# EAGLE design tinyLight_v1.1 (EAGLE 7.5.0)
tinyLight Small Serial USB device with WS2801 LED-Interface. Includes various meassurements and unused I/O-Pads.
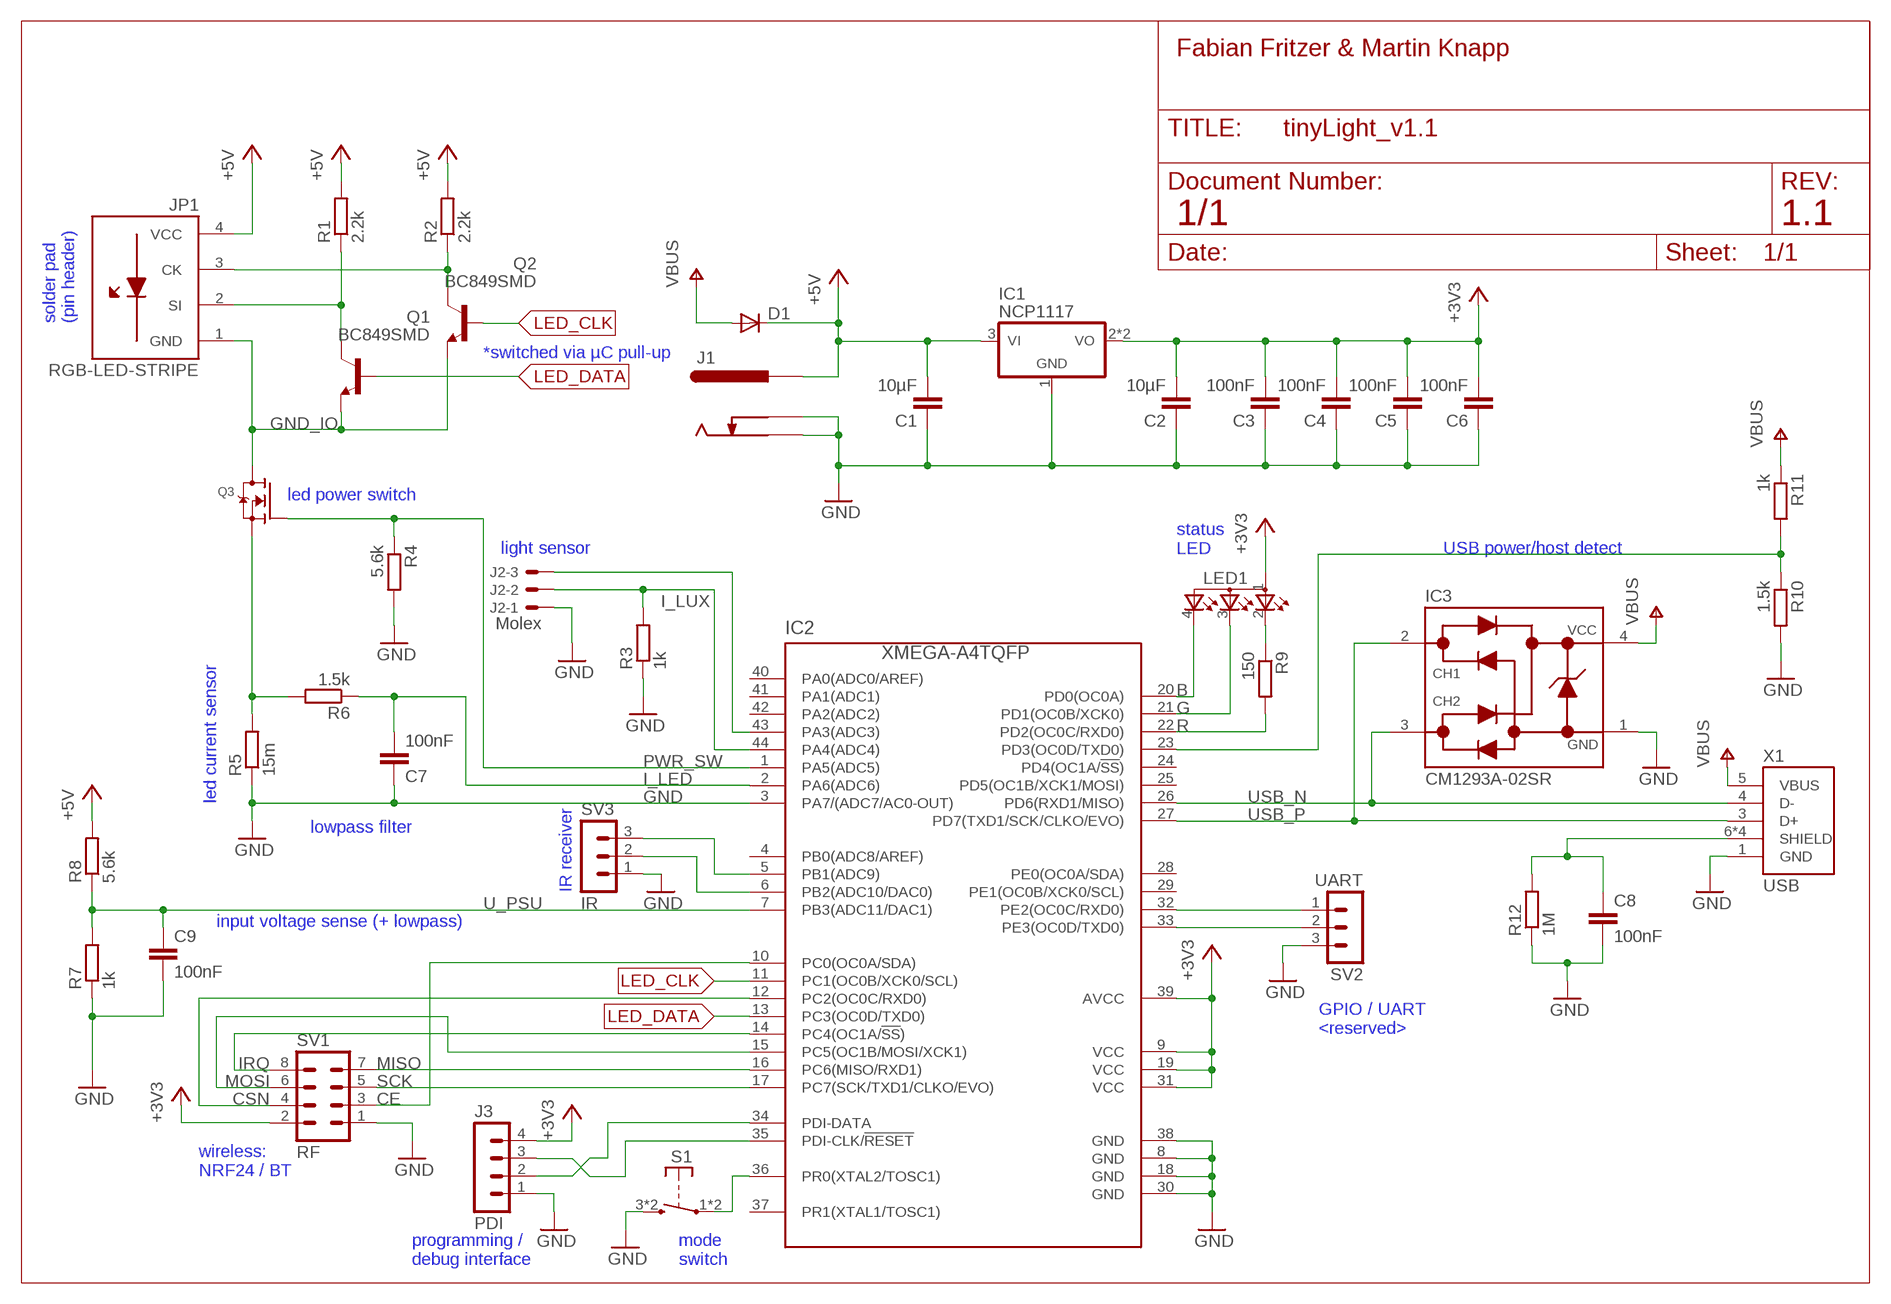
[diagram p0: schematic, sheet 1]

## Parts
C1  10µF  C-EUC2012  [C2012]
C2  10µF  C-EUC2012  [C2012]
C3  100nF  C-EUC2012  [C2012]
C4  100nF  C-EUC2012  [C2012]
C5  100nF  C-EUC2012  [C2012]
C6  100nF  C-EUC2012  [C2012]
C7  100nF  C-EUC2012  [C2012]
C8  100nF  C-EUC2012  [C2012]
C9  100nF  C-EUC2012  [C2012]
D1  DIODE-DO-214AC  [DO-214AC]
IC1  NCP1117  [SOT223]
IC2  XMEGA-A4TQFP  [TQFP44]
IC3  CM1293A-02SR  [SOT143]
J1  RASM722PX  [RASM722PX]
J2  Molex  22-27-2031-03  [6410-03]
J3  PDI  MA04-1  [MA04-1]
JP1  RGB-LED-STRIPE  [LED-STRIPE]
LED1  RGB-LEDMINI  [P-LCC-4_M]
Q1  BC849SMD  [SOT23-BEC]
Q2  BC849SMD  [SOT23-BEC]
Q3  MOSFET-N  [SOT457R_PHILIPS]
R1  2.2k  R-EU_M2012  [M2012]
R2  2.2k  R-EU_M2012  [M2012]
R3  1k  R-EU_M2012  [M2012]
R4  5.6k  R-EU_M2012  [M2012]
R5  15m  R-EU_M3216  [M3216]
R6  1.5k  R-EU_M2012  [M2012]
R7  1k  R-EU_M2012  [M2012]
R8  5.6k  R-EU_M2012  [M2012]
R9  150  R-EU_M2012  [M2012]
R10  1.5k  R-EU_M2012  [M2012]
R11  1k  R-EU_M2012  [M2012]
R12  1M  R-EU_M2012  [M2012]
S1  SPST_PB  [LSH_6X6]
SV1  RF  MA04-2  [MA04-2]
SV2  UART  MA03-1  [MA03-1]
SV3  IR  MA03-1  [MA03-1]
X1  MICRO-USB  [MIKRO_B]

## Nets
+3V3: C2.2 C3.2 C4.2 C5.2 C6.2 IC1.2(VOUT) IC1.T(VOUT) IC2.9(VCC) IC2.19(VCC) IC2.31(VCC) IC2.39(AVCC) J3.4 LED1.1(ANODE) SV1.2
+5V: C1.2 D1.C IC1.3(VIN) J1.TIP JP1.4(VCC) R1.2 R2.2 R8.2
B: IC2.20(PD0(OC0A)) LED1.4(CBLUE)
CE: IC2.10(PC0(OC0A/SDA)) SV1.3
CK: JP1.3(CK) Q2.C R2.1
CSN: IC2.12(PC2(OC0C/RXD0)) SV1.4
DATA: JP1.2(SI) Q1.C R1.1
G: IC2.21(PD1(OC0B/XCK0)) LED1.3(CGREEN)
GND: C1.1 C2.1 C3.1 C4.1 C5.1 C6.1 C7.1 C8.2 C9.2 IC1.1(GND) IC2.3(PA7/(ADC7/AC0-OUT)) IC2.8(GND) IC2.18(GND) IC2.30(GND) IC2.38(GND) IC3.1(GND) J1.SHUNT J1.SLEEVE(SLEVE) J2.1 J3.1 R3.1 R4.2 R5.1 R7.1 R10.2 R12.1 S1.3 S1.4 SV1.1 SV2.3 SV3.1 X1.1(GND)
GND_IO: JP1.1(GND) Q1.E Q2.E Q3.1(D) Q3.2(D) Q3.5(D) Q3.6(D)
I_LED: C7.2 IC2.2(PA6(ADC6)) R6.1
I_LUX: IC2.44(PA4(ADC4)) J2.2 R3.2
IRQ: IC2.14(PC4(OC1A/!SS!)) SV1.8
LED_CLK: IC2.11(PC1(OC0B/XCK0/SCL)) Q2.B
LED_DATA: IC2.13(PC3(OC0D/TXD0)) Q1.B
LED_R: LED1.2(CRED) R9.1
MISO: IC2.16(PC6(MISO/RXD1)) SV1.7
MOSI: IC2.15(PC5(OC1B/MOSI/XCK1)) SV1.6
N$2: IC2.6(PB2(ADC10/DAC0)) SV3.2
N$3: IC2.43(PA3(ADC3)) J2.3
N$10: IC2.33(PE3(OC0D/TXD0)) SV2.2
N$11: IC2.32(PE2(OC0C/RXD0)) SV2.1
N$12: IC2.36(PR0(XTAL2/TOSC1)) S1.1 S1.2
N$17: IC2.35(PDI-CLK/!RESET) J3.3
N$18: IC2.34(PDI-DATA) J3.2
N$27: IC2.5(PB1(ADC9)) SV3.3
PWR_SW: IC2.1(PA5(ADC5)) Q3.3(G) R4.1
R: IC2.22(PD2(OC0C/RXD0)) R9.2
SCK: IC2.17(PC7(SCK/TXD1/CLKO/EVO)) SV1.5
SHIELD: C8.1 R12.2 X1.6(SHIELD) X1.7(SHIELD) X1.8(SHIELD) X1.9(SHIELD)
U_PSU: C9.1 IC2.7(PB3(ADC11/DAC1)) R7.2 R8.1
USB_N: IC2.26(PD6(RXD1/MISO)) IC3.3(CH2) X1.4(D-)
USB_P: IC2.27(PD7(TXD1/SCK/CLKO/EVO)) IC3.2(CH1) X1.3(D+)
VBUS: D1.A IC3.4(VCC) R11.1 X1.5(VBUS)
VBUS_LOW: IC2.23(PD3(OC0D/TXD0)) R10.1 R11.2
VGND: Q3.4(S) R5.2 R6.2
Unconnected: IC2.4(PB0(ADC8/AREF)) IC2.24(PD4(OC1A/!SS!)) IC2.25(PD5(OC1B/XCK1/MOSI)) IC2.28(PE0(OC0A/SDA)) IC2.29(PE1(OC0B/XCK0/SCL)) IC2.37(PR1(XTAL1/TOSC1)) IC2.40(PA0(ADC0/AREF)) IC2.41(PA1(ADC1)) IC2.42(PA2(ADC2))

## Notes on the sheet
- Fabian Fritzer & Martin Knapp
- 1/1 | 1.1
- solder pad
  (pin header)
- *switched via µC pull-up
- led power switch
- light sensor
- status
  LED
- USB power/host detect
- led current sensor
- lowpass filter
- IR receiver
- input voltage sense (+ lowpass)
- GPIO / UART
  <reserved>
- wireless:
  NRF24 / BT
- programming / 
  debug interface
- mode
  switch

## Library data of the parts
C1-C9 = rcl:C-EU: CAPACITOR, European symbol
D1 = diode:DIODE-: DIODE
IC1 = tinyLight:NCP1117: LDO Voltage Regulators 3.3V 1A Positive
IC2 = avr-7:XMEGA-A4: Atmel XMega A4 series processor
IC3 = tinyLight:CM1293A-02SR
J1 = tinyLight:RASM722PX: Switchcraft DC Power Connectors RT ANG SU MT W/PLAS
J2 = con-molex:22-?-03: CONNECTOR wire to board 2.54 mm (.1 inch) pitch header; OC_FARNELL: unknown; OC_NEWARK: unknown
J3 = con-lstb:MA04-1: PIN HEADER; OC_FARNELL: unknown; OC_NEWARK: unknown
JP1 = tinyLight:RGB-LED-STRIPE: LED-Strip connection pads
LED1 = tinyLight:RGB-LED: Standard SMD RGB LED
Q1 Q2 = transistor-npn:BC849*: NPN Transistor
Q3 = tinyLight:MOSFET-N: N-Channel Mosfet 2N7002E - 60V 260mA SOT23 [Digikey: 2N7002ET1GOSTR-ND] - REEL BSH103 - 30V 850mA SOT23 [Digikey: 568-5013-1-ND]
R1-R12 = rcl:R-EU_: RESISTOR, European symbol
S1 = tinyLight:SPST_PB: Pushbutton Switches 6X6 SHORT TRAVEL SWITCH 9.5MM
SV1 = con-lstb:MA04-2: PIN HEADER; OC_FARNELL: unknown; OC_NEWARK: unknown
SV2 SV3 = con-lstb:MA03-1: PIN HEADER; OC_FARNELL: unknown; OC_NEWARK: unknown
X1 = tinyLight:MICRO-USB: USB Connectors microUSB 2.0 TYPE B STDMNT RCPT NO TAPER

## Net classes
0 default: width 0.2 mm, clearance 0.6 mm

## Board
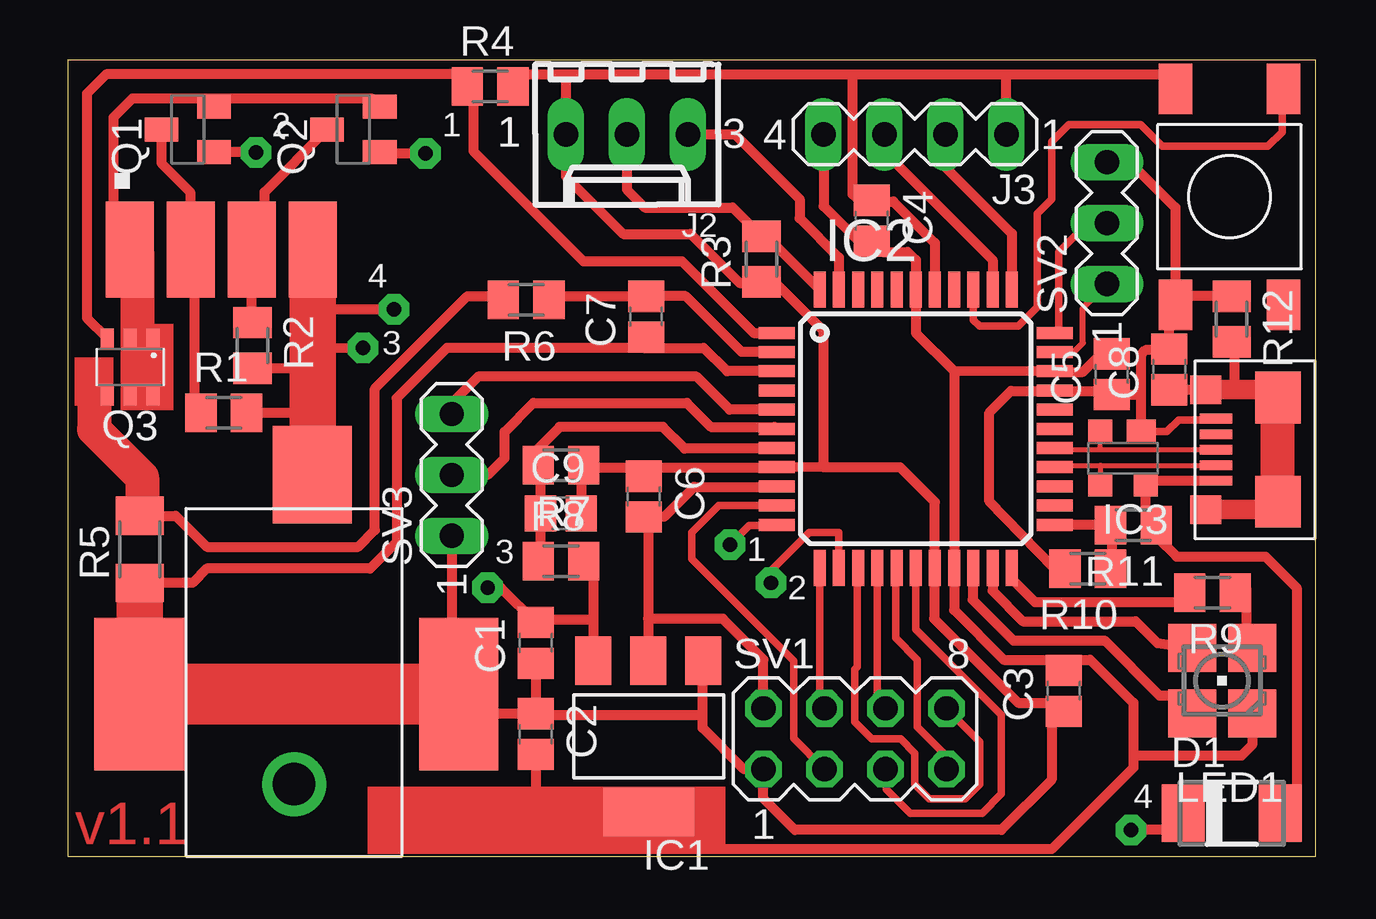
[diagram p1: board, top side]
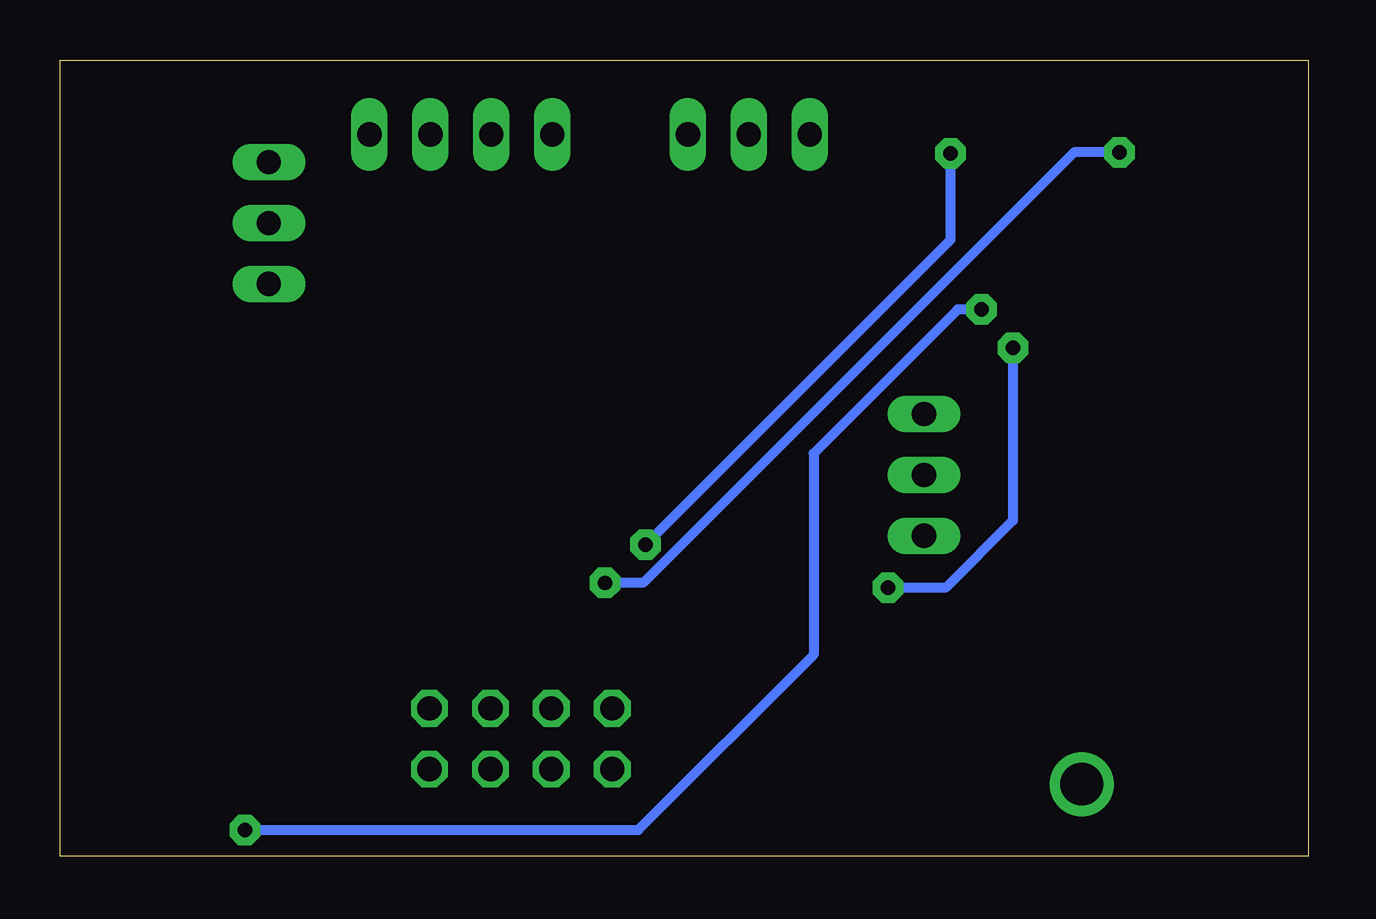
[diagram p2: board, bottom side, seen from below]

Size 52 x 33.2 mm. Coordinates in mm from the lower left corner, seen from the top.
Outline: 52,0 52,33.2 0,33.2 0,0 52,0
Copper layers (1*16): Top 0.035mm / dielectric 1.5mm / Bottom 0.035mm
Design rules "default *": minimum track width 0.2mm, minimum drill 0.6mm, track to track 0.1mm, track to pad 0.2mm, pad to pad 0.2mm, via to via 0.2mm, smd to smd 0.2mm, copper to edge 0.6mm, drill to drill 0.6mm, minimum pad ring 10mil, minimum via ring 8mil, stop-mask expansion 4mil, vias tented up to drill 0mil, thermal gap 10mil

### Footprints (pad centres in the part's own frame; a part is rotated, then mirrored left to right if it is on the bottom)
C2012 = smd 1.3 x 1.5: 1 -0.85,0; 2 0.85,0
DO-214AC = smd 1.8 x 2.4: A 2.025,0; C -2.025,0
SOT223 = smd 1.499 x 2.007: 1 -2.261,-3.15; 2 0.025,-3.15; 3 2.311,-3.15 | smd 3.81 x 2.007: T 0,3.15
TQFP44 = smd 1.5 x 0.5: 1 -5.8,4; 2 -5.8,3.2; 3 -5.8,2.4; 4 -5.8,1.6; 5 -5.8,0.8; 6 -5.8,0; 7 -5.8,-0.8; 8 -5.8,-1.6; 9 -5.8,-2.4; 10 -5.8,-3.2; 11 -5.8,-4; 23 5.8,-4; 24 5.8,-3.2; 25 5.8,-2.4; 26 5.8,-1.6; 27 5.8,-0.8; 28 5.8,0; 29 5.8,0.8; 30 5.8,1.6; 31 5.8,2.4; 32 5.8,3.2; 33 5.8,4 | smd 0.5 x 1.5: 12 -4,-5.8; 13 -3.2,-5.8; 14 -2.4,-5.8; 15 -1.6,-5.8; 16 -0.8,-5.8; 17 0,-5.8; 18 0.8,-5.8; 19 1.6,-5.8; 20 2.4,-5.8; 21 3.2,-5.8; 22 4,-5.8; 34 4,5.8; 35 3.2,5.8; 36 2.4,5.8; 37 1.6,5.8; 38 0.8,5.8; 39 0,5.8; 40 -0.8,5.8; 41 -1.6,5.8; 42 -2.4,5.8; 43 -3.2,5.8; 44 -4,5.8
SOT143 = smd 1.2 x 1: 1 -0.75,-1.1 | smd 1 x 1: 2 0.95,-1.1; 3 0.95,1.1; 4 -0.95,1.1
RASM722PX = drill 1.78 pad 2: P$2 0,0 | smd 3.81 x 6.35: SHUNT -6.43,3.76 | smd 3.3 x 6.35: SLEEVE 6.86,3.76 | smd 3.3 x 4.06: TIP 0.76,12.9
6410-03 = drill 1.016 long: 1 2.54,0; 2 0,0; 3 -2.54,0
MA04-1 = drill 1.016 long: 1 -3.81,0; 2 -1.27,0; 3 1.27,0; 4 3.81,0
LED-STRIPE = smd 2 x 4: 1 -3.81,0; 2 -1.27,0; 3 1.27,0; 4 3.81,0
P-LCC-4_M = smd 2 x 2: 1 -1.365,-1.245; 2 1.365,-1.245; 3 1.365,1.245; 4 -1.365,1.245
SOT23-BEC = smd 1 x 1.4: B -0.95,-1.1; C 0,1.1; E 0.95,-1.1
SOT457R_PHILIPS = smd 0.55 x 0.8: 1 -0.95,-1.2; 2 0,-1.2; 3 0.95,-1.2; 4 0.95,1.2; 5 0,1.2; 6 -0.95,1.2
M2012 = smd 1.3 x 1.6: 1 -0.95,0; 2 0.95,0
M3216 = smd 1.6 x 2: 1 -1.4,0; 2 1.4,0
LSH_6X6 = smd 2.1 x 1.4: 1 -4.5,2.25; 2 4.5,2.25; 3 -4.5,-2.25; 4 4.5,-2.25
MA04-2 = drill 1.016 octagon: 1 -3.81,-1.27; 2 -3.81,1.27; 3 -1.27,-1.27; 4 -1.27,1.27; 5 1.27,-1.27; 6 1.27,1.27; 7 3.81,-1.27; 8 3.81,1.27
MA03-1 = drill 1.016 long: 1 -2.54,0; 2 0,0; 3 2.54,0
MIKRO_B = smd 0.4 x 1.35: 1 1.3,0; 2 0.65,0; 3 0,0; 4 -0.65,0; 5 -1.3,0 | smd 2.15 x 1.9: 6 -2.175,-2.575; 7 2.175,-2.575 | smd 1.2 x 1.3: 8 -2.5,0.425; 9 2.5,0.425

### Placement (x,y rotation side)
C1  19.5,8.9 90 top
C2  19.5,5.1 270 top
C3  41.5,6.9 90 top
C4  33.5,26.5 270 top
C5  43.5,20.1 90 top
C6  24,15 270 top
C7  24.1,22.5 90 top
C8  45.9,20.3 90 top
C9  20.55,14.3 0 top
D1  48.5,1.8 0 top
IC1  24.21,5.01 180 top
IC2  35.33,17.82 0 top
IC3  43.98,16.6 180 top
J1  9.43,3.01 0 top
J2  23.3,30.1 180 top
J3  35.3,30.1 180 top
JP1  6.4,25.3 0 top
LED1  48.1,7.33 90 top
Q1  5,30.3 90 top
Q2  11.9,30.3 90 top
Q3  2.6,20.4 180 top
R1  6.5,18.5 0 top
R2  7.7,21.3 270 top
R3  28.9,24.9 90 top
R4  17.6,32.1 0 top
R5  3,12.8 90 top
R6  19.1,23.2 180 top
R7  20.55,16.3 180 top
R8  20.55,12.3 0 top
R9  47.7,11 180 top
R10  42.5,12 180 top
R11  44.4,13.8 180 top
R12  48.5,22.4 270 top
S1  48.4,27.5 270 top
SV1  32.8,4.9 0 top
SV2  43.3,26.4 90 top
SV3  16,15.9 90 top
U$1  [OSHW_8X100_NOTEXT]  15.4,25 0 top
X1  47.85,16.95 90 top

### Tracks (layer width: path | path; a pad name or v marks a point on that pad's centre or on a via)
+3V3
  Top 0.254: IC2.31 41.16,20.2
  Top 0.4: IC2.31 36.93,20.22
  Top 0.406: IC2.9 29.51,15.4 26.1,15.4 24.85,14.15 C6.2 | C2.2 19.5,1.86 IC1.T 25.57,0.3 41,0.3 44.4,3.7 44.4,4.1 | 24.55,13.85 23.5,13.85 C6.2 | 24.18,9.9 24.18,14.15 C6.2 | 24.18,9.9 IC1.2 | 49.4,6.17 LED1.1 49.34,4.64 48.9,4.2 44.5,4.2 44.4,4.1 | J3.4 31.5,27.1 32.95,25.65 C4.2 33.95,25.2 35,25.2 35.33,24.87 IC2.39 35.33,21.82 36.93,20.22 IC2.19 36.93,10.27 39,8.2 41.05,8.2 C3.2 41.5,8.2 42.6,8.2 44.4,6.4 44.4,4.1 | 41.16,20.2 42.3,20.2 43.05,20.95 C5.2 | 24.18,9.9 27.3,9.9 28.99,8.21 SV1.2
+5V  (via drill 0.6 pad 1.27)
  Top 0.4: v12.3,21.2 10.21,21.2
  Top 0.406: R1.2 10.21,18.5 | R2.2 10.21,20.35 10.21,20.1 | R8.2 21.9,11.7 21.9,9.85 | 21.9,9.85 IC1.3 | v17.5,11.2 18.05,11.2 C1.2 19.5,9.85 21.9,9.85 | D1.C 45.77,1.1 v44.3,1.1 | v13.6,22.8 10.21,22.8
  Top 1.93: JP1.4 10.21,22.8 10.21,21.2 10.21,20.1 10.21,18.5 10.21,15.79 J1.TIP
  Bottom 0.406: v12.3,21.2 12.3,14 15.1,11.2 v17.5,11.2 | v44.3,1.1 27.9,1.1 20.6,8.4 20.6,16.8 14.6,22.8 v13.6,22.8
B
  Top 0.406: IC2.20 37.7,11.99 37.7,10.7 39.4,9 43.2,9 45.5,6.7 46.72,6.7 LED1.4
CE
  Top 0.305: IC2.10 27.12,14.62 26,13.5 26,12.4 30.25,8.15 30.25,4.91 SV1.3
CK
  Top 0.406: R2.1 7.55,22.2 7.67,22.32 JP1.3 8.2,25.83 8.2,27.7 Q2.C
CSN
  Top 0.305: IC2.12 31.33,6.37 SV1.4
DATA
  Top 0.406: JP1.2 5.55,25.3 | R1.1 5.3,18.5 5.3,24 5.13,24 JP1.2 | Q1.C 3.9,28.9 5.1,27.7 5.1,25.33 JP1.2
G
  Top 0.406: IC2.21 38.53,11.07 39.8,9.8 44.5,9.8 45.41,8.89 LED1.3
GND
  Top 0.305: X1.1 47.8,18.2 46.3,18.2 45.8,17.7 IC3.1
  Top 0.4: IC2.8 31.5,16.22 | J1.SLEEVE 17.51,5.95
  Top 0.406: R12.1 46.05,23.35 S1.4 | IC2.8 29.51,16.2 24,16.2 | 24,16.2 21.6,16.2 R7.1 21.4,16.2 C9.2 | S1.4 45.95,22.65 45.9,22.15 C8.2 45.65,21.1 44.9,21.1 44.7,20.9 44.7,19.4 | R10.2 41.1,12 38.4,14.8 38.4,18.5 39.3,19.4 41.11,19.4 | C2.1 17.51,5.95 | C2.1 19.5,5.9 26.45,5.9 | 26.45,5.9 26.45,7.88 IC1.1 | C1.1 C2.1 | IC2.3 27.48,20.22 26.5,21.2 24.1,21.2 | 3.6,12 R5.1 5.2,11.4 5.8,12 12.6,12 13.7,13.1 13.7,19.1 15.8,21.2 24,21.2 | 23.95,15.7 C6.1 23.85,15.7 23.85,16.05 24,16.2 | 24,21.2 24,21.3 C7.1 24.1,21.2 | 24,21.2 24.1,21.2 | 46.15,32.6 S1.3 45.95,32.6 39,32.6 | 26.45,5.9 26.45,5.35 28.17,3.63 SV1.1 28.99,2.41 30.3,1.1 38.9,1.1 41,3.2 41,6.25 | J3.1 39.11,32.49 39,32.6 | SV2.3 43.34,28.9 44.3,28.9 46.15,27.05 S1.4 | IC2.38 36.13,25.57 34.4,27.3 33.55,27.3 C4.1 32.95,27.35 32.7,27.6 32.7,32.6 | 20.76,32.6 32.7,32.6 | 32.7,32.6 39,32.6 | 44.7,19.4 44.7,17.73 IC3.1 | 44.7,19.4 44.65,19.25 C5.1 43.25,19.4 41.11,19.4 | 41.11,19.4 IC2.30 | 15,6.97 15.2,6.77 | SV3.1 16,7.06 J1.SLEEVE | C3.1 41.15,6.4 41,6.25 | R4.2 18.65,32.6 20.76,32.6 | 20.76,32.6 J2.1 20.76,28.34 23.15,25.95 25.95,25.95 28,23.9 28.65,23.9 R3.1 29.45,23.95 31.5,21.9 31.5,16.22 34.68,16.22 36.13,14.77 IC2.18 36.1,11.99 36.1,9.9 39.6,6.4 40.85,6.4 41,6.25
  Top 1.016: R5.1 3,10.8
  Top 1.93: 3,10.8 J1.SHUNT
  Top 2.54: J1.SHUNT 15.2,6.77 J1.SLEEVE
GND_IO
  Top 0.406: Q3.6 Q3.5 Q3.2 | Q3.2 Q3.1 | 2.9,22 2.6,21.7 Q3.2 | 2.9,25.09 2.59,25.09 JP1.1 1.9,25.99 1.9,30.8 2.7,31.6 6.25,31.6 | 6.25,31.6 Q1.E | 6.25,31.6 12.65,31.6 Q2.E
  Top 1.422: 2.9,25.09 2.9,22
I_LED
  Top 0.406: IC2.2 28.08,21.02 25.75,23.35 C7.2 20.1,23.35 R6.1
I_LUX
  Top 0.406: J2.2 23.3,27.8 24.05,27.05 27.7,27.05 R3.2 28.75,25.8 29.2,25.8 29.2,25.76 IC2.44
IRQ
  Top 0.305: 32.9,12.02 32.9,7.9 32.8,7.8 32.8,5.6 33.5,4.9 34.7,4.9 35.3,4.3 35.3,3 35.9,2.4 37.4,2.4 38,3 38,4.78 SV1.8
  Top 0.406: IC2.14 32.9,12.02
LED_CLK  (via drill 0.6 pad 1.27)
  Top 0.305: 29.1,13.8 28.4,13.8 v27.6,13
  Top 0.4: IC2.11 29.5,13.79 29.3,13.79 29.1,13.8
  Top 0.406: v14.9,29.3 13,29.3 Q2.B
  Bottom 0.406: v14.9,29.3 14.9,25.7 v27.6,13
LED_DATA  (via drill 0.6 pad 1.27)
  Top 0.305: IC2.13 32.13,13.5 30.9,13.5 29.3,11.9 v29.3,11.4
  Top 0.406: v7.85,29.35 Q1.B
  Bottom 0.406: v7.85,29.35 9.75,29.35 27.7,11.4 v29.3,11.4
LED_R
  Top 0.406: R9.1 49.1,11.2 49.1,9 49.45,9 LED1.2
MISO
  Top 0.305: 34.5,11.99 34.5,9.1 35.4,8.2 35.4,5.4 36.61,4.19 SV1.7
  Top 0.406: 34.5,11.99 IC2.16
MOSI
  Top 0.305: IC2.15 33.73,6.51 SV1.6
N$2
  Top 0.406: 29.51,17.8 IC2.6 29.46,17.9 26.8,17.9 25.8,18.9 19.4,18.9 18.2,17.7 18.2,16.6 17.5,15.9 SV3.2
N$3
  Top 0.406: IC2.43 32.13,24.97 30.5,26.6 30.5,27.4 27.8,30.1 J2.3
N$10
  Top 0.305: SV2.2 42.5,26.4 41.3,25.2 41.3,21.82
  Top 0.406: 41.3,21.82 IC2.33
N$11
  Top 0.254: IC2.32 41.92,21.02 42.3,21.4 42.3,22.86 SV2.1
N$12
  Top 0.305: IC2.36 37.73,22.37 38,22.1 39.6,22.1 40.4,22.9 40.4,26.8 41,27.4 41,29.8 41.7,30.5 44.7,30.5 45.6,29.6 50,29.6 50.6,30.2 50.6,31.95
  Top 0.406: 50.6,31.85 S1.1 50.6,31.95
N$17
  Top 0.406: 38.56,23.65 IC2.35 38.53,24.87 34,29.4 34,30.07 J3.3
N$18
  Top 0.406: J3.2 36.6,30.07 36.6,28.7 39.33,25.97 IC2.34
N$27
  Top 0.406: IC2.5 27.58,18.62 26.2,20 17.1,20 16,18.9 SV3.3
N$29
  Top 0.406: 29.5,17.8 29.5,17.83
N$30
  Top 0.406: 29.2,18.6 29.2,18.62
N$31
  Top 0.406: 29.4,19.4 29.4,19.44
PWR_SW
  Top 0.406: Q3.3 0.8,22.45 0.8,31.8 1.6,32.6 16.9,32.6 | IC2.1 28.58,21.82 25.6,24.8 21.5,24.8 16.9,29.4 16.9,32.05 R4.1 16.9,32.15 16.9,32.6 | 17,32.6 16.9,32.6
R
  Top 0.4: IC2.22 39.33,11.57
  Top 0.406: 39.33,11.57 40.3,10.6 46.3,10.6 46.7,11.1 R9.2
SCK
  Top 0.305: IC2.17 35.33,9.47 38.9,5.9 38.9,2.6 38.1,1.8 35.1,1.8 34.1,2.8 34.1,3.8
  Top 0.406: 34.1,3.8 SV1.5
SHIELD
  Top 0.406: X1.9 47.42,19.53 | R12.2 48.55,21.45 48.6,21.4 48.6,19.45 | X1.9 | X1.9 C8.1
  Top 0.813: X1.8 50.1,14.45 X1.6 | X1.9 48.6,19.45 50.1,19.45 X1.7
  Top 1.422: X1.6 X1.7
U_PSU
  Top 0.406: IC2.7 29.51,17 25.7,17 24.8,17.9 20.5,17.9 19.6,17 R7.2 19.7,16.2 C9.1 19.7,12.3 R8.1
USB_N
  Top 0.2: IC2.26 41.21,16.3 43.03,16.3 | 43.03,16.3 IC3.3 | 43.03,16.3 X1.4
USB_P
  Top 0.2: IC2.27 41.21,16.95 43.03,16.95 | 43.03,16.95 IC3.2 | 43.03,16.95 X1.3
VBUS
  Top 0.406: X1.5 45.08,15.65 IC3.4 44.93,14.32 | R11.1 44.93,14.32 | 44.93,14.32 45.4,14.32 45.4,13.3 46.2,12.5 49.9,12.5 51.2,11.2 51.2,2.6 50.52,1.93 D1.A
VBUS_LOW
  Top 0.406: IC2.23 43.43,13.82 R11.2 43.2,13.8 | 43.2,13.8 43.15,13.85 | 43.2,13.8 43.5,13.5 43.5,12 R10.1
VGND
  Top 0.406: 2.9,14.3 R5.2 4.5,14.2 5.8,12.9 12.1,12.9 12.8,13.6 12.8,19.5 16.65,23.35 17.65,23.35 17.8,23.2 R6.2 18.1,23.3 | Q3.4 1.1,19.2
  Top 1.422: 1.1,19.2 1.1,17.8 3.1,15.8 3.1,14.3 R5.2
(copper drawn outside any net)
  shapes: Top area x3

### Text on the board
Top: v1.1
tPlace: 2 | 1 | 4 | 3 | 3 | 1 | 2 | 4